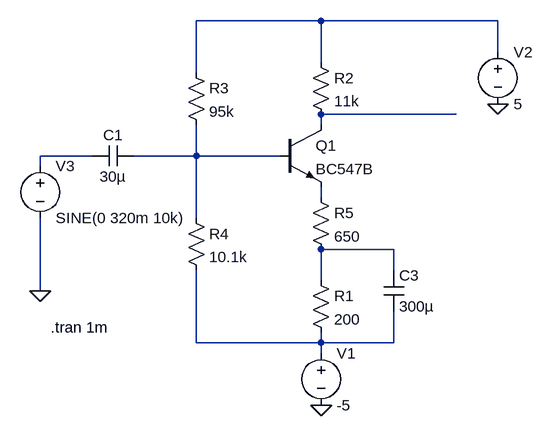
[diagram p0: schematic CE Amplifier.asc]
CE Amplifier.asc, the LTspice schematic file:
Version 4.1
SHEET 1 880 680
WIRE 320 16 128 16
WIRE 592 16 320 16
WIRE 592 64 592 16
WIRE 320 80 320 16
WIRE 128 96 128 16
WIRE 528 160 320 160
WIRE 320 176 320 160
WIRE -32 224 -112 224
WIRE 128 224 128 176
WIRE 128 224 32 224
WIRE 256 224 128 224
WIRE -112 240 -112 224
WIRE 320 288 320 272
WIRE 128 320 128 224
WIRE 432 368 320 368
WIRE 432 400 432 368
WIRE 320 416 320 368
WIRE -112 432 -112 320
WIRE 128 512 128 400
WIRE 320 512 320 496
WIRE 320 512 128 512
WIRE 432 512 432 464
WIRE 432 512 320 512
WIRE 320 528 320 512
FLAG 592 144 0
FLAG 320 608 0
FLAG -112 432 0
SYMBOL res 304 64 R0
SYMATTR InstName R2
SYMATTR Value 11k
SYMBOL voltage 592 48 R0
WINDOW 123 0 0 Left 0
WINDOW 39 0 0 Left 0
SYMATTR InstName V2
SYMATTR Value 5
SYMBOL npn 256 176 R0
SYMATTR InstName Q1
SYMATTR Value BC547B
SYMBOL voltage -112 224 R0
WINDOW 123 24 124 Left 2
WINDOW 39 0 0 Left 0
SYMATTR InstName V3
SYMATTR Value SINE(0 320m 10k)
SYMBOL res 304 400 R0
SYMATTR InstName R1
SYMATTR Value 200
SYMBOL res 112 80 R0
SYMATTR InstName R3
SYMATTR Value 95k
SYMBOL res 112 304 R0
SYMATTR InstName R4
SYMATTR Value 10.1k
SYMBOL cap 416 400 R0
SYMATTR InstName C3
SYMATTR Value 300µ
SYMBOL voltage 320 512 R0
WINDOW 123 0 0 Left 0
WINDOW 39 0 0 Left 0
SYMATTR InstName V1
SYMATTR Value -5
SYMBOL cap 32 208 R90
WINDOW 0 0 32 VBottom 2
WINDOW 3 32 32 VTop 2
SYMATTR InstName C1
SYMATTR Value 30µ
SYMBOL res 304 272 R0
SYMATTR InstName R5
SYMATTR Value 650
TEXT -96 488 Left 2 !.tran 1m

The netlist it stands for:
* CE Amplifier.asc
R2 N001 N002 11k
V2 N001 0 5
Q1 N002 N004 N005 0 BC547B
V3 N003 0 SINE(0 320m 10k)
R1 N006 N007 200
R3 N001 N004 95k
R4 N004 N007 10.1k
C3 N006 N007 300µ
V1 N007 0 -5
C1 N004 N003 30µ
R5 N005 N006 650
.model NPN NPN
.model PNP PNP
.lib standard.bjt
.tran 1m
.backanno
.end